# EAGLE design GAlarm-board (EAGLE 6.4)
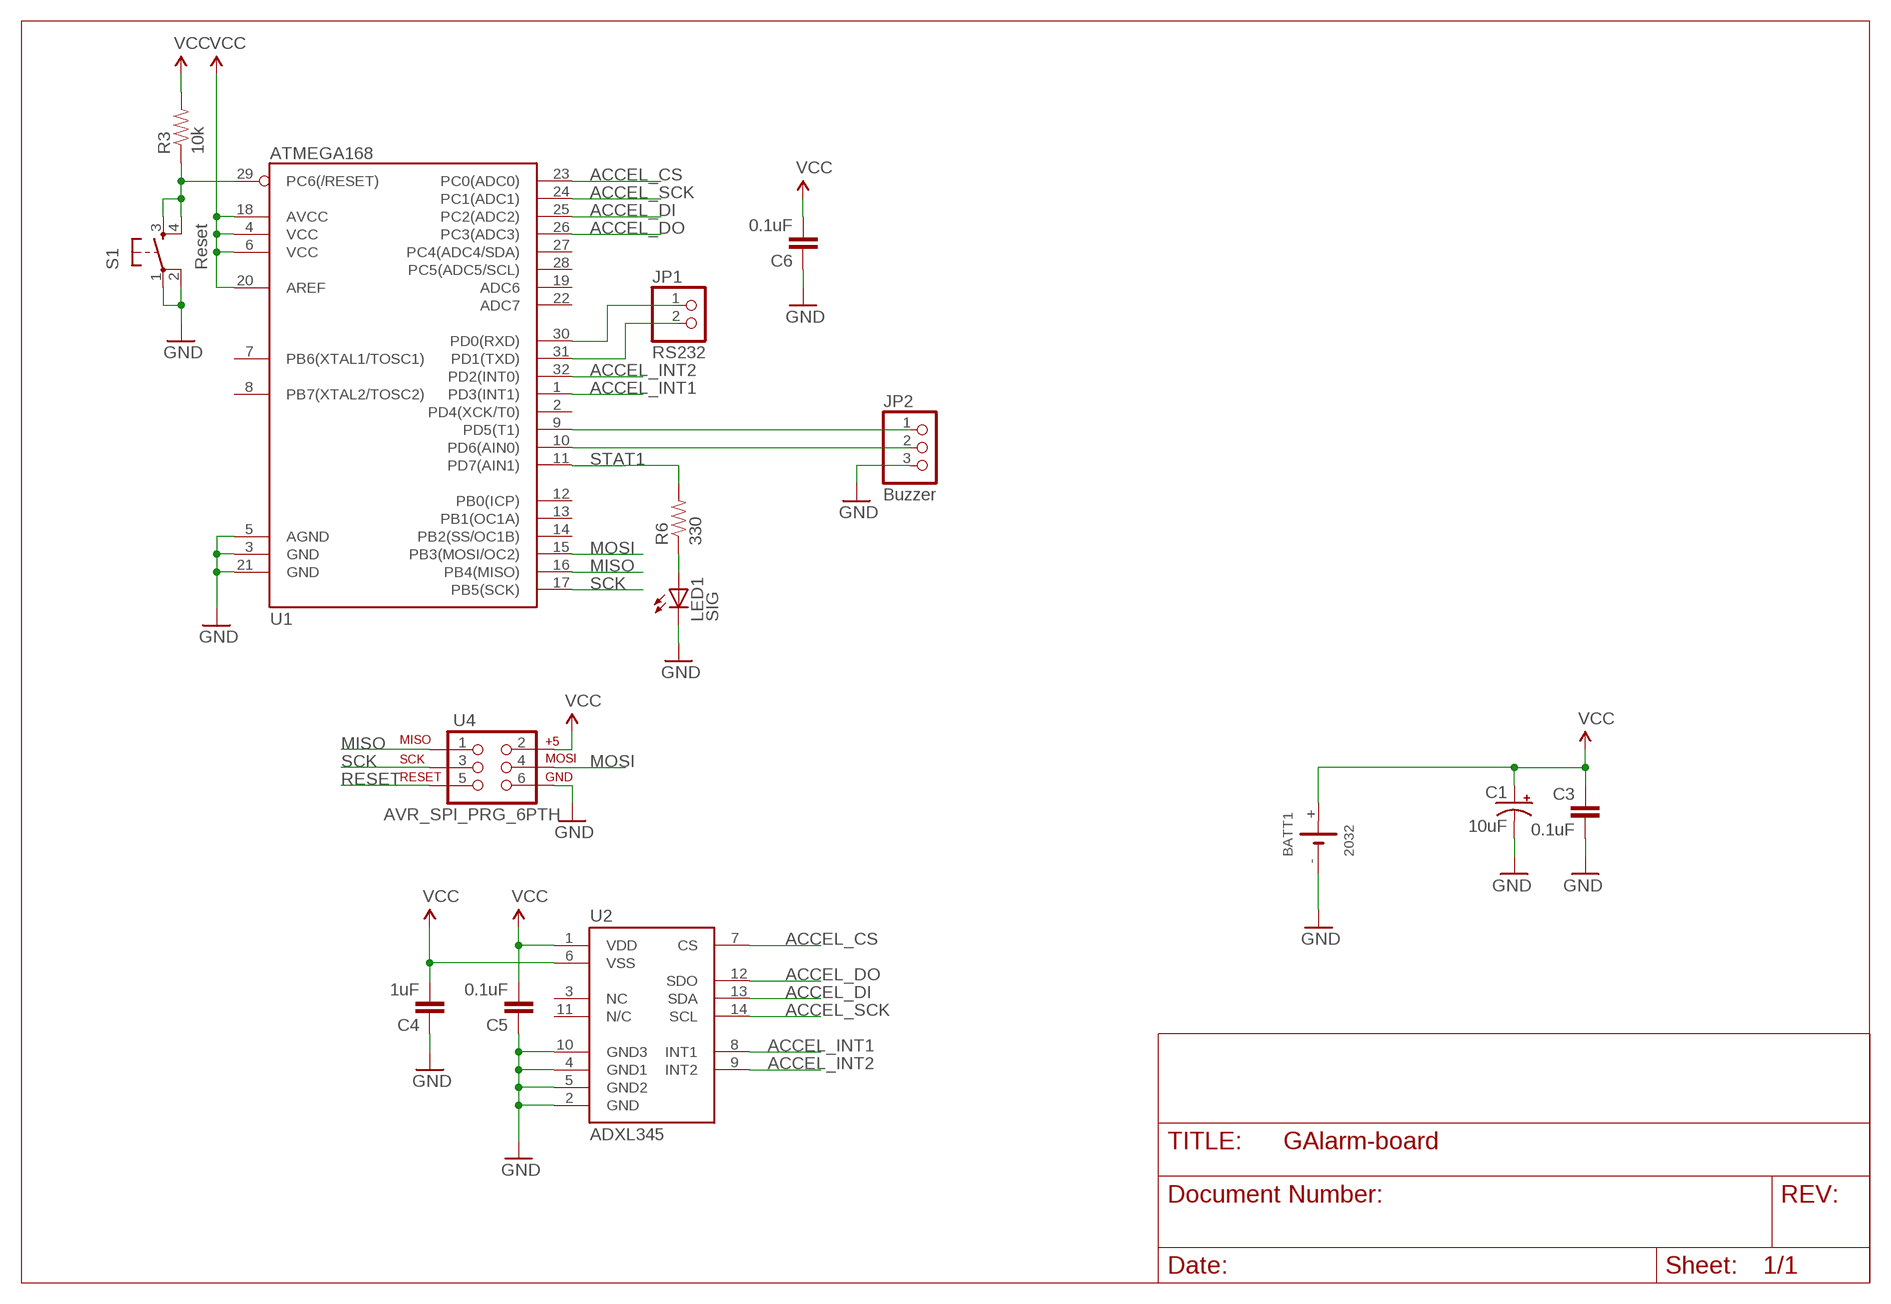
[diagram p0: schematic, sheet 1]

## Parts
BATT1  2032  CR2032_HOLDSMD  [2032_SMD]
C1  10uF  CAP_POL1206  [EIA3216]
C3  0.1uF  CAP0603-CAP  [0603-CAP]
C4  1uF  CAP0805  [0805]
C5  0.1uF  CAP0603-CAP  [0603-CAP]
C6  0.1uF  CAP0603-CAP  [0603-CAP]
JP1  RS232  PINHD-1X2  [1X02]
JP2  Buzzer  PINHD-1X3  [1X03]
LED1  SIG  LED0603  [LED-0603]
R3  10k  RESISTOR0603-RES  [0603-RES]
R6  330  RESISTOR0603-RES  [0603-RES]
S1  Reset  TAC_SWITCHSMD  [TACTILE_SWITCH_SMD]
U1  ATMEGA168  [TQFP32-08]
U2  ADXL345  [LGA14]
U4  AVR_SPI_PRG_6PTH  [2X3]

## Nets
ACCEL_CS: U1.23(PC0(ADC0)) U2.7(CS)
ACCEL_DI: U1.25(PC2(ADC2)) U2.13(SDA)
ACCEL_DO: U1.26(PC3(ADC3)) U2.12(SDO)
ACCEL_INT1: U1.1(PD3(INT1)) U2.8(INT1)
ACCEL_INT2: U1.32(PD2(INT0)) U2.9(INT2)
ACCEL_SCK: U1.24(PC1(ADC1)) U2.14(SCL)
GND: BATT1.- C1.C(-) C3.2 C4.1 C5.1 C6.1 JP2.3 LED1.C S1.1 S1.2 U1.3(GND) U1.5(AGND) U1.21(GND) U2.2(GND) U2.4(GND1) U2.5(GND2) U2.10(GND3) U4.6
MISO: U1.16(PB4(MISO)) U4.1
MOSI: U1.15(PB3(MOSI/OC2)) U4.4
N$1: LED1.A R6.1
N$2: JP2.2 U1.10(PD6(AIN0))
N$3: JP1.1 U1.30(PD0(RXD))
N$4: JP1.2 U1.31(PD1(TXD))
N$5: JP2.1 U1.9(PD5(T1))
RESET: R3.1 S1.3 S1.4 U1.29(PC6(/RESET)) U4.5
SCK: U1.17(PB5(SCK)) U4.3
STAT1: R6.2 U1.11(PD7(AIN1))
VCC: BATT1.+ C1.A(+) C3.1 C4.2 C5.2 C6.2 R3.2 U1.4(VCC) U1.6(VCC) U1.18(AVCC) U1.20(AREF) U2.1(VDD) U2.6(VSS) U4.2
Unconnected: U1.2(PD4(XCK/T0)) U1.7(PB6(XTAL1/TOSC1)) U1.8(PB7(XTAL2/TOSC2)) U1.12(PB0(ICP)) U1.13(PB1(OC1A)) U1.14(PB2(SS/OC1B)) U1.19(ADC6) U1.22(ADC7) U1.27(PC4(ADC4/SDA)) U1.28(PC5(ADC5/SCL)) U2.3(NC) U2.11(N/C)

## Library data of the parts
BATT1 = El_Mech:CR2032_HOLD: Batteriehalter 2032; BESCHREIBUNG: Batteriehalter SMD; HERSTELLER: z.B. Würth; HERST_NR: z.B. 795 271 41; SIZE: 2032
C1 = SparkFun:CAP_POL: Capacitor Polarized These are standard SMD and PTH capacitors. Normally 10uF, 47uF, and 100uF in electrolytic and tantalum varieties. Always verify the external diameter of the through hole cap, it varies with capacity, voltage, and manufacturer. The EIA devices should be standard.
C3-C6 = SparkFun:CAP: Capacitor Standard 0603 ceramic capacitor, and 0.1" leaded capacitor.
JP1 = pinhead:PINHD-1X2: PIN HEADER
JP2 = pinhead:PINHD-1X3: PIN HEADER
LED1 = SparkFun:LED: LEDs Standard schematic elements and footprints for 5mm, 3mm, 1206, and 0603 sized LEDs. 5mm - Spark Fun Electronics SKU : COM-00529 (and others)
R3 R6 = SparkFun:RESISTOR: Resistor Basic schematic elements and footprints for 0603, 1206, and PTH 1/10th watt (small) resistors.
S1 = SparkFun:TAC_SWITCH: Momentary Switch Button commonly used for reset or general input. Spark Fun Electronics SKU : COM-00097
U1 = SparkFun:ATMEGA168
U2 = SparkFun:ADXL345
U4 = SparkFun:AVR_SPI_PRG_6: AVR ISP 6 Pin This is the reduced ISP connector for AVR programming. Common on Arduino. This footprint will take up less PCB space and can be used with a 10-pin to 6-pin adapter such as SKU: BOB-08508

## Board
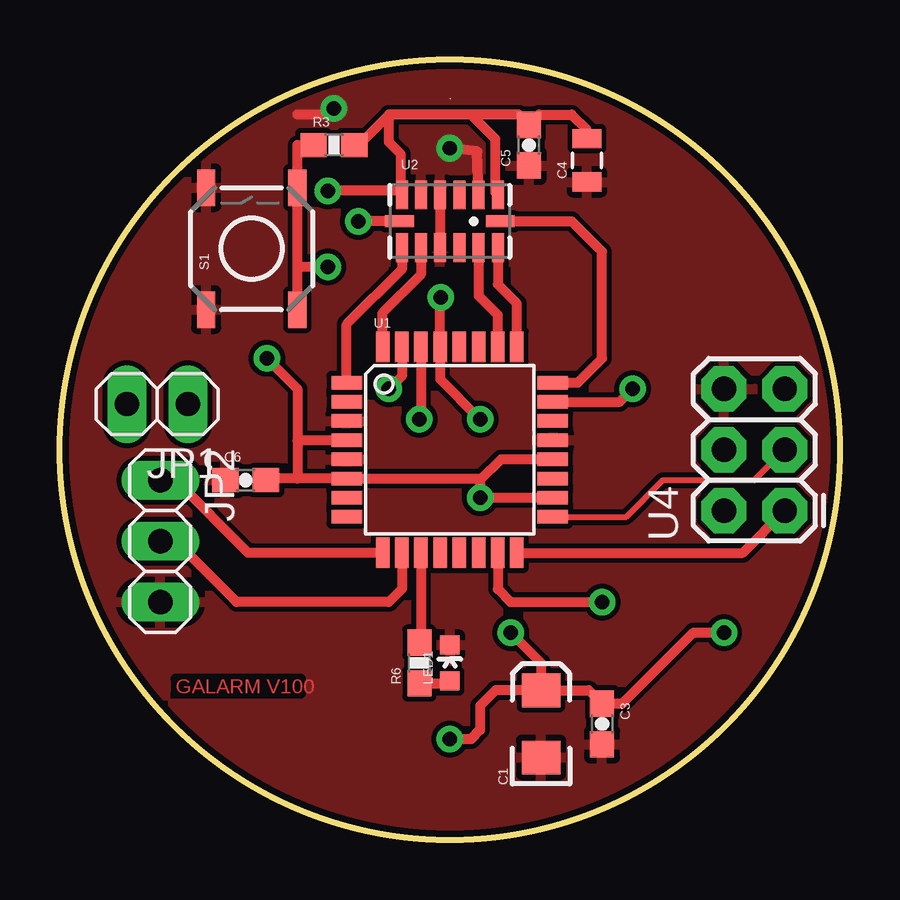
[diagram p1: board, top side]
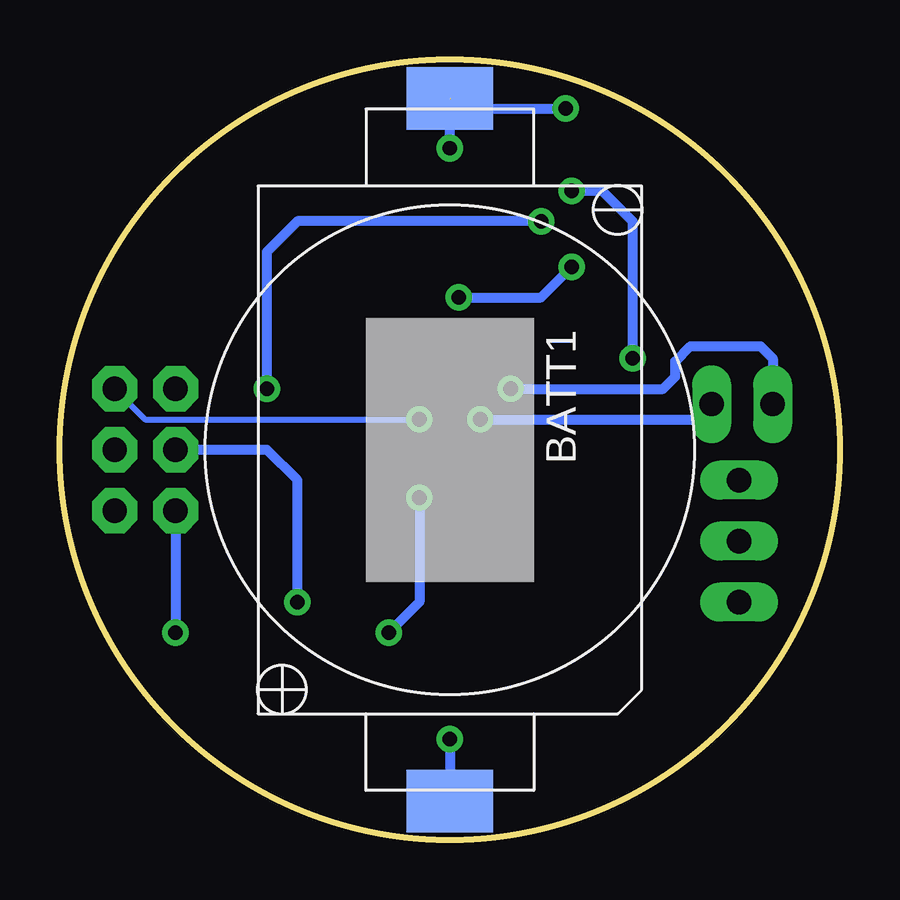
[diagram p2: board, bottom side, seen from below]

Size 32.5 x 32.5 mm. Coordinates in mm from the lower left corner, seen from the top.
Outline: circle at 16.25,16.25 radius 16.25
Copper layers (1*16): Top 0.035mm / dielectric 1.5mm / Bottom 0.035mm
Design rules "SparkFun": minimum track width 8mil, minimum drill 20mil, track to track 8mil, track to pad 8mil, pad to pad 8mil, via to via 8mil, smd to smd 8mil, copper to edge 10mil, drill to drill 8mil, minimum pad ring 12mil, minimum via ring 10mil, stop-mask expansion 4mil, vias tented up to drill 25mil, thermal gap 10mil
tRestrict: area 13.7,21.3 to 18.8,23.9; area 14.1,24.5 to 18.4,27

### Footprints (pad centres in the part's own frame; a part is rotated, then mirrored left to right if it is on the bottom)
2032_SMD = smd 3.6 x 2.6: + 0,-14.65; - 0,14.65
EIA3216 = smd 1.4 x 1.6: A 1.4,0; C -1.4,0
0603-CAP = smd 1.1 x 1: 1 -0.85,0; 2 0.85,0
0805 = smd 0.8 x 1.2: 1 -0.9,0; 2 0.9,0
1X02 = drill 1.016 long: 1 -1.27,0; 2 1.27,0
1X03 = drill 1.016 long: 1 -2.54,0; 2 0,0; 3 2.54,0
LED-0603 = smd 0.8 x 0.8: A 0,-0.75; C 0,0.75
0603-RES = smd 1.1 x 1: 1 -0.85,0; 2 0.85,0
TACTILE_SWITCH_SMD = smd 1.524 x 0.762: 1 -2.54,1.905; 2 2.54,1.905; 3 -2.54,-1.905; 4 2.54,-1.905
TQFP32-08 = smd 1.27 x 0.559: 1 -4.293,2.8; 2 -4.293,2; 3 -4.293,1.2; 4 -4.293,0.4; 5 -4.293,-0.4; 6 -4.293,-1.2; 7 -4.293,-2; 8 -4.293,-2.8; 17 4.293,-2.8; 18 4.293,-2; 19 4.293,-1.2; 20 4.293,-0.4; 21 4.293,0.4; 22 4.293,1.2; 23 4.293,2; 24 4.293,2.8 | smd 0.559 x 1.27: 9 -2.8,-4.293; 10 -2,-4.293; 11 -1.2,-4.293; 12 -0.4,-4.293; 13 0.4,-4.293; 14 1.2,-4.293; 15 2,-4.293; 16 2.8,-4.293; 25 2.8,4.293; 26 2,4.293; 27 1.2,4.293; 28 0.4,4.293; 29 -0.4,4.293; 30 -1.2,4.293; 31 -2,4.293; 32 -2.8,4.293
LGA14 = smd 0.5 x 1.2: 1 2,1.1; 2 1.2,1.1; 3 0.4,1.1; 4 -0.4,1.1; 5 -1.2,1.1; 6 -2,1.1; 8 -2,-1.1; 9 -1.2,-1.1; 10 -0.4,-1.1; 11 0.4,-1.1; 12 1.2,-1.1; 13 2,-1.1 | smd 1.2 x 0.5: 7 -2.1,0; 14 2.1,0
2X3 = drill 1.016 pad 1.88 octagon: 1 0,0; 2 0,2.54; 3 2.54,0; 4 2.54,2.54; 5 5.08,0; 6 5.08,2.54

### Placement (x,y rotation side)
BATT1  16.25,16.25 0 bottom
C1  20.06,4.82 90 top
C3  22.6,4.82 270 top
C4  21.96,28.32 90 top
C5  19.55,28.95 90 top
C6  7.74,14.98 0 top
JP1  4.06,18.16 180 top
JP2  4.19,12.44 270 top
LED1  16.25,7.36 0 top
R3  11.42,28.95 0 top
R6  14.98,7.36 90 top
S1  8,24.63 90 top
U1  16.25,16.25 0 top
U2  16.25,25.77 0 top
U4  30.22,13.71 90 top

### Tracks (layer width: path | path; a pad name or v marks a point on that pad's centre or on a via)
ACCEL_CS  (via drill 0.6)
  Top 0.406: U2.7 v12.44,25.77 | U1.23 23.33,18.25 v23.87,18.79
  Bottom 0.406: v12.44,25.77 22.6,25.77 23.87,24.51 v23.87,18.79
ACCEL_DI
  Top 0.406: U1.25 19.05,22.34 18.25,23.14 U2.13
ACCEL_DO
  Top 0.406: U1.26 18.25,21.87 17.45,22.67 U2.12
ACCEL_INT1
  Top 0.406: U2.8 14.25,23.77 11.96,21.48 U1.1
ACCEL_INT2
  Top 0.406: U1.32 13.45,21.96 15.05,23.56 U2.9
ACCEL_SCK
  Top 0.406: U2.14 21.33,25.77 22.6,24.51 22.6,20.06 21.59,19.05 U1.24
GND  (via drill 0.6 pad 0.41)  (1 unrouted)
  Top 0.406: v11.42,30.47 11.17,30.22 9.9,30.22 | U2.2 17.39,28.7 v16.25,28.82 | U2.4 U2.10
  Bottom 0.406: 16.25,30.85 15.87,30.47 v11.42,30.47 | v16.25,28.82 BATT1.-
  pour Top: -0.26,16.25 arc90 16.25,-0.26 arc90 32.76,16.25 arc90 16.25,32.76 arc90
MISO
  Top 0.406: U1.16 28.47,11.96 U4.1
MOSI  (via drill 0.6)
  Top 0.406: U1.15 18.25,10.44 18.79,9.9 v22.6,9.9
  Bottom 0.406: v22.6,9.9 22.6,14.98 23.87,16.25 U4.4
N$1
  Top 0.406: R6.1 16.15,6.51 LED1.A
N$2
  Top 0.406: U1.10 14.25,10.44 13.71,9.9 7.36,9.9 4.82,12.44 JP2.2
N$3  (via drill 0.6)
  Top 0.406: U1.30 15.05,17.59 v14.98,17.52
  Bottom 0.406: v14.98,17.52 5.96,17.52 JP1.1
N$4  (via drill 0.6 pad 0.41)
  Top 0.406: U1.31 14.25,19.33 v13.71,18.79
  Bottom 0.406: v13.71,18.79 7.36,18.79 6.85,19.3 6.85,19.93 6.22,20.57 3.3,20.57 2.79,20.06 JP1.2
N$5
  Top 0.406: U1.9 7.84,11.96 4.82,14.98 JP2.1
RESET  (via drill 0.6)
  Top 0.406: S1.3 9.9,23.87 | 9.9,23.87 S1.4 9.9,28.95 R3.1 | v17.52,17.52 15.85,19.19 U1.29 15.85,22.2 v15.87,22.6 | v11.17,23.87 9.9,23.87
  Bottom 0.254: v17.52,17.52 28.95,17.52 U4.5
  Bottom 0.406: v15.87,22.6 12.44,22.6 v11.17,23.87
SCK
  Top 0.254: U1.17 23.61,13.45 25.14,14.98 28.95,14.98 U4.3
STAT1
  Top 0.406: U1.11 15.05,8.28 R6.2
VCC  (via drill 0.6, 0.6 pad 0.41)
  Top 0.406: C1.A 22.05,6.22 C3.1 23.45,5.67 26.41,8.63 v27.68,8.63 | U1.18 v17.52,14.25 17.52,14.98 | U1.20 18.39,15.85 17.52,14.98 | 17.52,14.98 17.45,15.05 U1.6 9.9,15.05 | 9.9,15.05 8.66,15.05 C6.2 | C1.A 18.16,6.22 17.52,5.58 17.52,4.57 17.14,4.19 v16.25,4.19 | v18.79,8.63 20.06,7.36 C1.A | 17.14,30.22 19.13,30.22 C5.2 19.97,30.22 21.33,30.22 21.96,29.59 C4.2 | 17.14,30.22 13.71,30.22 | 13.71,30.22 12.44,28.95 R3.2 | U2.1 18.16,26.97 18.16,29.2 17.14,30.22 | 13.71,30.22 13.71,29.08 14.22,28.57 14.22,26.91 U2.6 14.08,27.04 v11.17,27.04 | U1.4 11.94,16.63 9.9,16.63 | 9.9,16.63 9.9,15.05 | v8.63,20.06 9.9,18.79 9.9,16.63
  Bottom 0.406: U4.2 v27.68,8.63 | v16.25,4.19 BATT1.+ | v17.52,14.25 17.52,9.9 v18.79,8.63 | v11.17,27.04 9.9,27.04 8.63,25.77 v8.63,20.06

### Text on the board
Top: GALARM V100